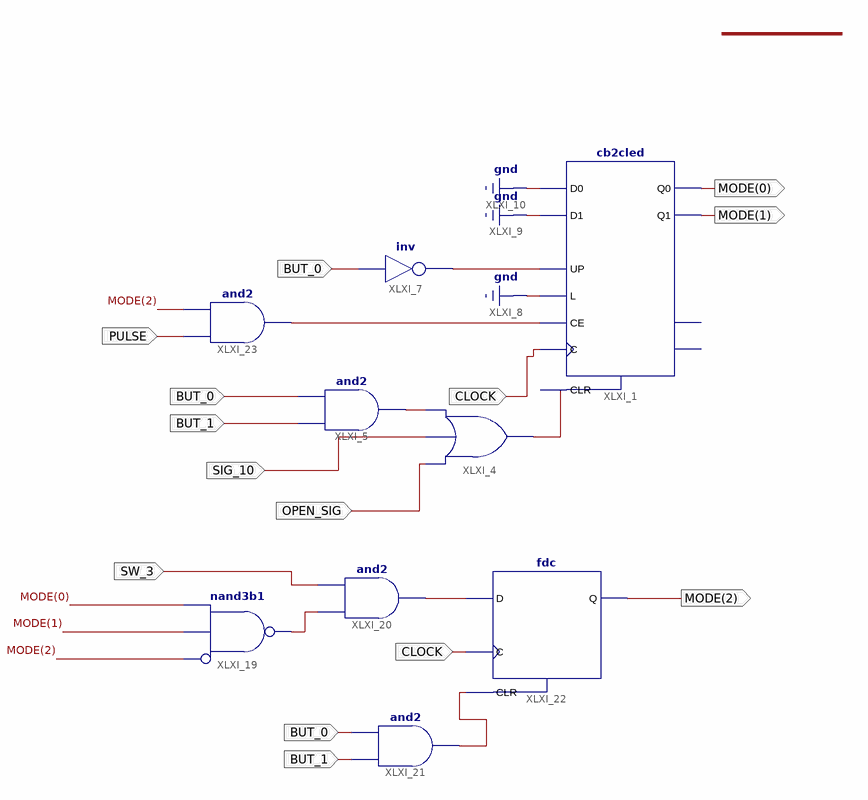
[diagram p0: schematic sheet 1]
// Xilinx ISE schematic MODE_SELECT.sch (spartan3e) as structural Verilog: 9 symbols, 10 ports
module MODE_SELECT (
  input  CLOCK,
  input  BUT_0,
  input  OPEN_SIG,
  input  SIG_10,
  input  BUT_1,
  input  SW_3,
  input  PULSE,
  output [2:0] MODE
);

  wire XLXN_5, XLXN_8, XLXN_13, XLXN_40, XLXN_41, XLXN_43, XLXN_45;

  cb2cled XLXI_1 (
    .C(CLOCK), .CE(XLXN_45), .CLR(XLXN_5), .D0(1'b0), .D1(1'b0), .L(1'b0), .UP(XLXN_13), .Q0(MODE[0]),
    .Q1(MODE[1]));  // open: CEO, TC
  not XLXI_7 (XLXN_13, BUT_0);
  or XLXI_4 (XLXN_5, OPEN_SIG, SIG_10, XLXN_8);
  and XLXI_5 (XLXN_8, BUT_1, BUT_0);
  nand XLXI_19 (XLXN_40, ~MODE[2], MODE[1], MODE[0]);  // nand3b1
  and XLXI_20 (XLXN_41, XLXN_40, SW_3);
  and XLXI_21 (XLXN_43, BUT_1, BUT_0);
  fdc XLXI_22 (.C(CLOCK), .CLR(XLXN_43), .D(XLXN_41), .Q(MODE[2]));
  and XLXI_23 (XLXN_45, PULSE, MODE[2]);
endmodule
